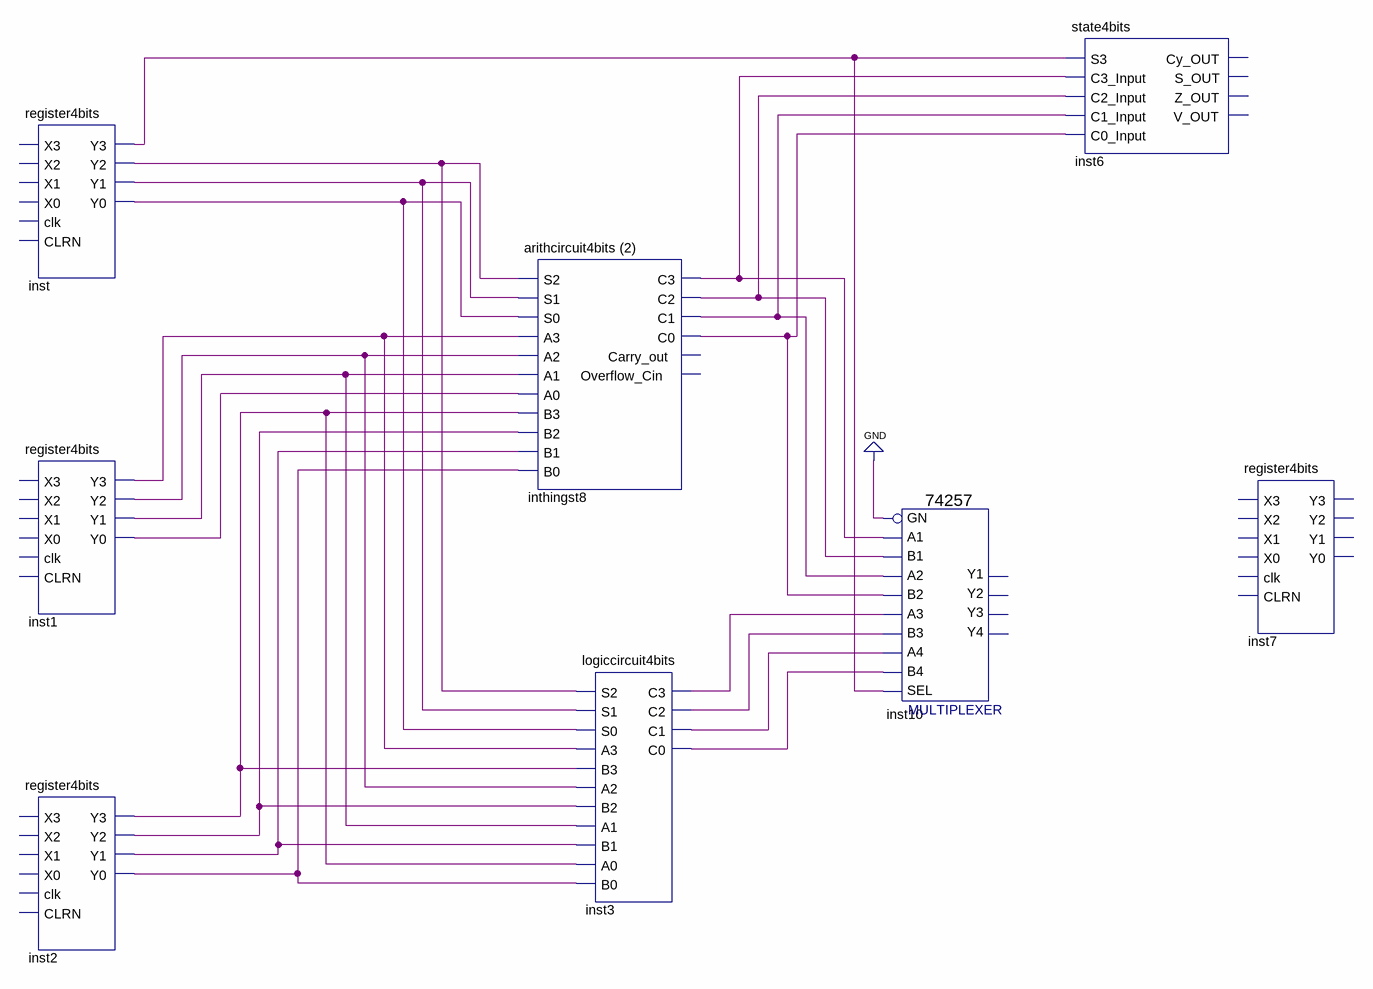
[diagram p0: schematic sheet]
// Quartus schematic Block2.bdf as structural Verilog: 8 symbols, 0 pins
module Block2 (
);

  wire inst1_y0, inst1_y1, inst1_y2, inst1_y3, inst2_y0, inst2_y1, inst2_y2, inst2_y3, inst3_c0, inst3_c1,
       inst3_c2, inst3_c3, inst_y0, inst_y1, inst_y2, inst_y3, inthingst8_c0, inthingst8_c1, inthingst8_c2,
       inthingst8_c3;

  register4bits inst (.Y3(inst_y3), .Y2(inst_y2), .Y1(inst_y1), .Y0(inst_y0));  // open: X3, X2, X1, X0, clk, CLRN
  register4bits inst1 (.Y3(inst1_y3), .Y2(inst1_y2), .Y1(inst1_y1), .Y0(inst1_y0));  // open: X3, X2, X1, X0, clk, CLRN
  register4bits inst2 (.Y3(inst2_y3), .Y2(inst2_y2), .Y1(inst2_y1), .Y0(inst2_y0));  // open: X3, X2, X1, X0, clk, CLRN
  \arithcircuit4bits_(2)  inthingst8 (
    .S2(inst_y2), .S1(inst_y1), .S0(inst_y0), .A3(inst1_y3), .A2(inst1_y2), .A1(inst1_y1), .A0(inst1_y0),
    .B3(inst2_y3), .B2(inst2_y2), .B1(inst2_y1), .B0(inst2_y0), .C3(inthingst8_c3), .C2(inthingst8_c2),
    .C1(inthingst8_c1), .C0(inthingst8_c0));  // open: Carry_out, Overflow_Cin
  logiccircuit4bits inst3 (
    .S2(inst_y2), .S1(inst_y1), .S0(inst_y0), .A3(inst1_y3), .B3(inst2_y3), .A2(inst1_y2), .B2(inst2_y2),
    .A1(inst1_y1), .B1(inst2_y1), .A0(inst2_y3), .B0(inst2_y0), .C3(inst3_c3), .C2(inst3_c2), .C1(inst3_c1),
    .C0(inst3_c0));
  \74257  inst10 (
    .B1(inthingst8_c2), .A1(inthingst8_c3), .B3(inst3_c2), .A2(inthingst8_c1), .B2(inthingst8_c0),
    .A3(inst3_c3), .A4(inst3_c1), .B4(inst3_c0), .SEL(inst_y3), .GN(1'b0));  // open: Y2, Y3, Y4, Y1
  state4bits inst6 (
    .S3(inst_y3), .C3_Input(inthingst8_c3), .C2_Input(inthingst8_c2), .C1_Input(inthingst8_c1),
    .C0_Input(inthingst8_c0));  // open: Cy_OUT, S_OUT, Z_OUT, V_OUT
  register4bits inst7 ();  // open: X3, X2, X1, X0, clk, CLRN, Y3, Y2, Y1, Y0
endmodule
